# EAGLE design intercom (EAGLE 5.11)
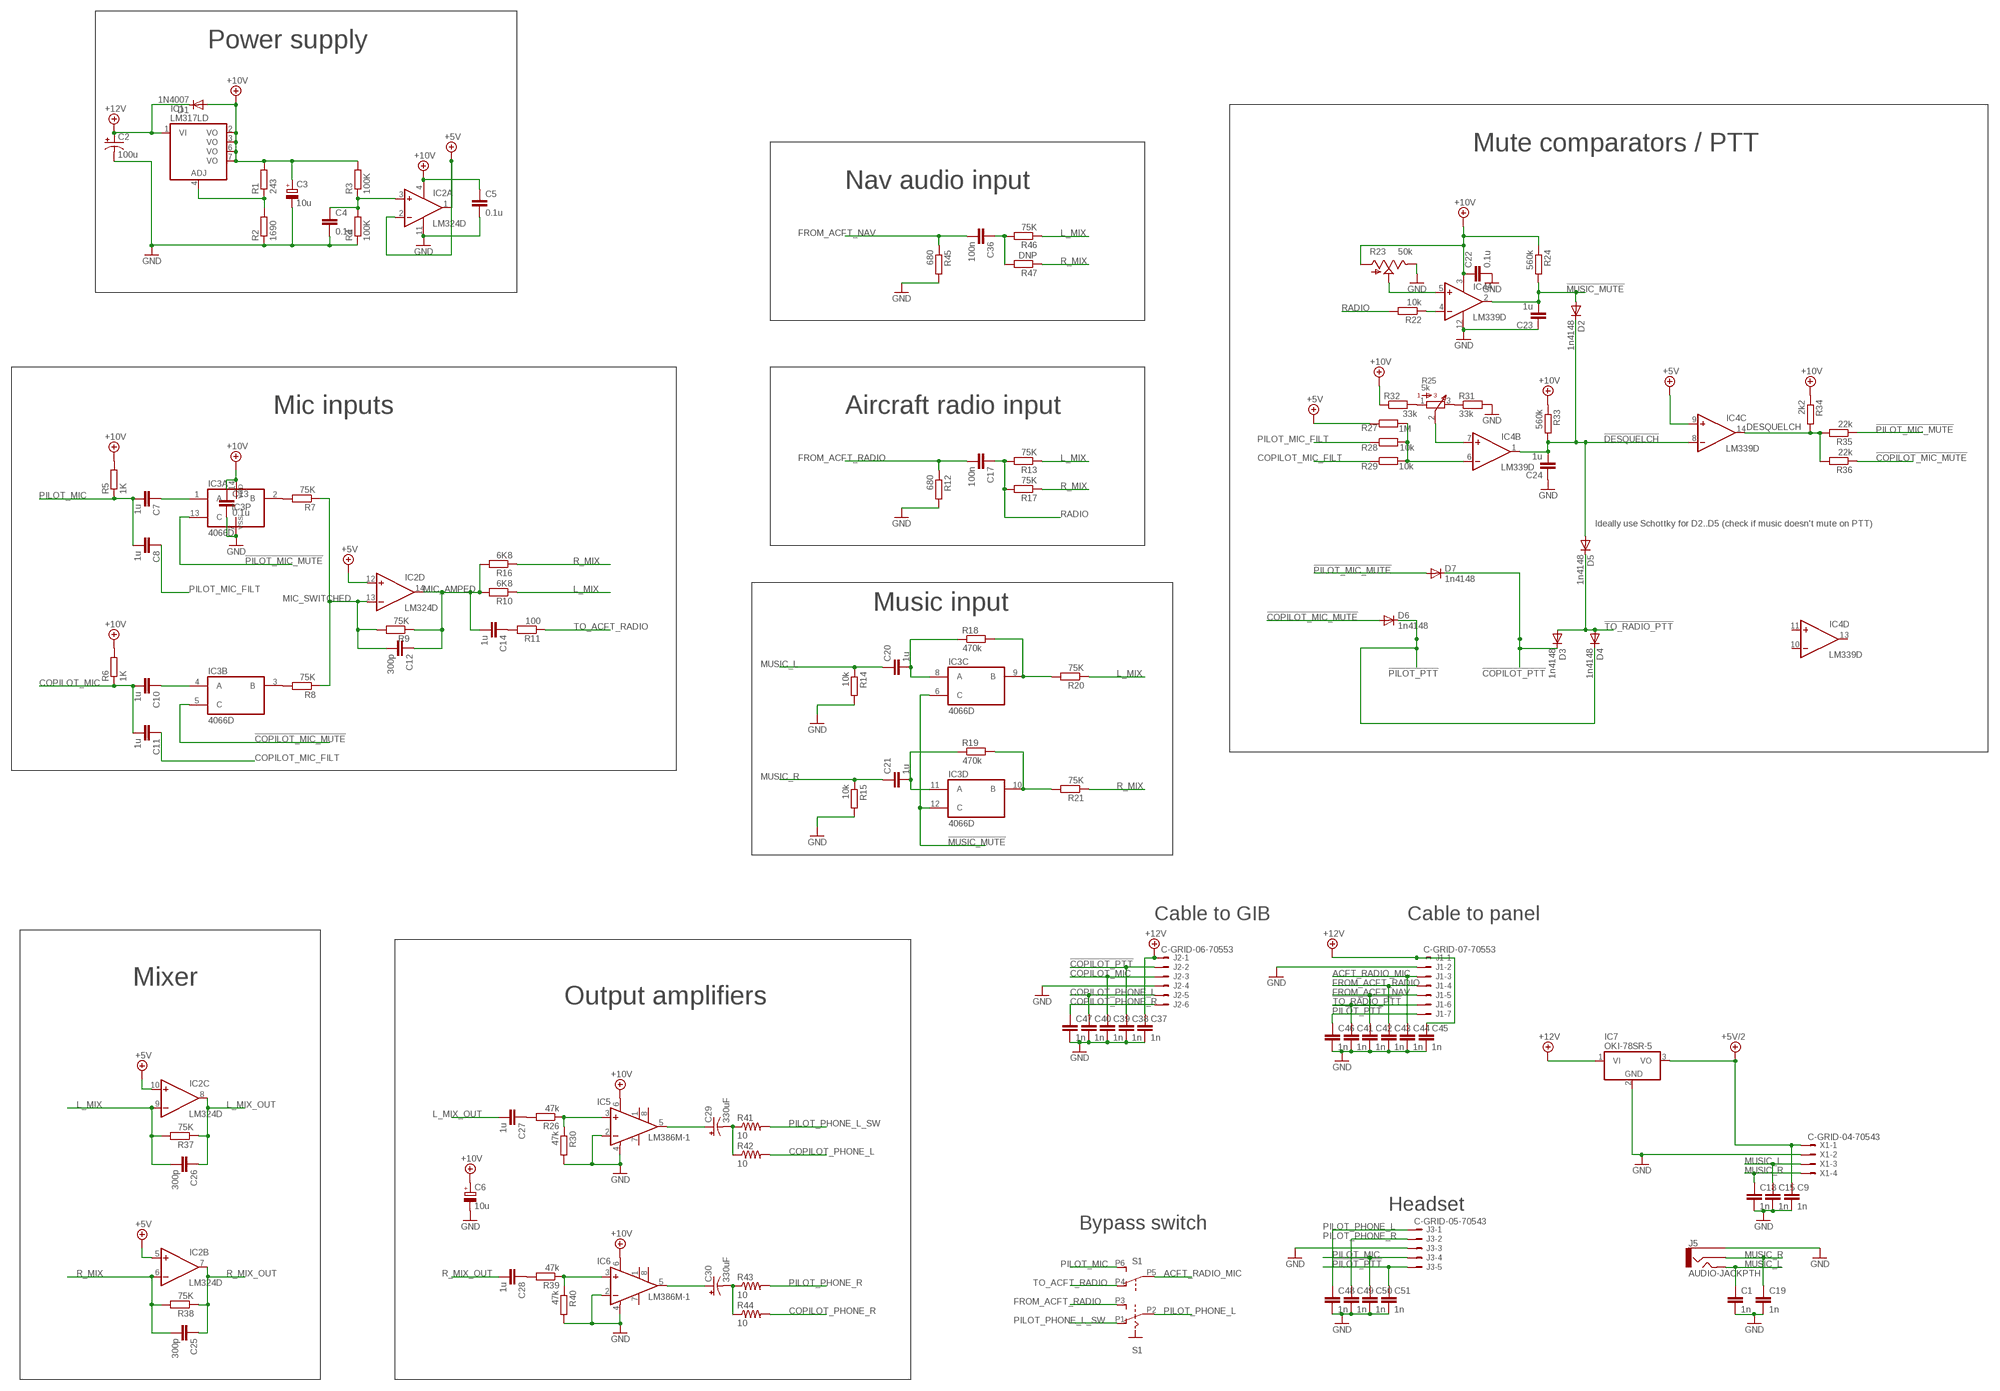
[diagram p0: schematic, sheet 1]

## Parts
C1  1n  C-EUC0603  [C0603]
C2  100u  CPOL-USE2.5-7  [E2,5-7]
C3  10u  CPOL-EUCT3216  [CT3216]
C4  0.1u  C-EUC0603  [C0603]
C5  0.1u  C-EUC0603  [C0603]
C6  10u  CPOL-EUCT3216  [CT3216]
C7  1u  C-EUC0603  [C0603]
C8  1u  C-EUC0603  [C0603]
C9  1n  C-EUC0603  [C0603]
C10  1u  C-EUC0603  [C0603]
C11  1u  C-EUC0603  [C0603]
C12  300p  C-EUC0603  [C0603]
C13  0.1u  C-EUC0603  [C0603]
C14  1u  C-EUC0603  [C0603]
C15  1n  C-EUC0603  [C0603]
C17  100n  C-EUC0603  [C0603]
C18  1n  C-EUC0603  [C0603]
C19  1n  C-EUC0603  [C0603]
C20  1u  C-EUC0603  [C0603]
C21  1u  C-EUC0603  [C0603]
C22  0.1u  C-EUC0603  [C0603]
C23  1u  C-EUC0603  [C0603]
C24  1u  C-EUC0603  [C0603]
C25  300p  C-EUC0603  [C0603]
C26  300p  C-EUC0603  [C0603]
C27  1u  C-EUC0603  [C0603]
C28  1u  C-EUC0603  [C0603]
C29  330uF  CPOL-USE3.5-8  [E3,5-8]
C30  330uF  CPOL-USE3.5-8  [E3,5-8]
C36  100n  C-EUC0603  [C0603]
C37  1n  C-EUC0603  [C0603]
C38  1n  C-EUC0603  [C0603]
C39  1n  C-EUC0603  [C0603]
C40  1n  C-EUC0603  [C0603]
C41  1n  C-EUC0603  [C0603]
C42  1n  C-EUC0603  [C0603]
C43  1n  C-EUC0603  [C0603]
C44  1n  C-EUC0603  [C0603]
C45  1n  C-EUC0603  [C0603]
C46  1n  C-EUC0603  [C0603]
C47  1n  C-EUC0603  [C0603]
C48  1n  C-EUC0603  [C0603]
C49  1n  C-EUC0603  [C0603]
C50  1n  C-EUC0603  [C0603]
C51  1n  C-EUC0603  [C0603]
D1  1N4007  DIODE-C1702-05  [C1702-05]
D2  1n4148  DIODE-SOD323-W  [SOD323-W]
D3  1n4148  DIODE-SOD323-W  [SOD323-W]
D4  1n4148  DIODE-SOD323-W  [SOD323-W]
D5  1n4148  DIODE-SOD323-W  [SOD323-W]
D6  1n4148  DIODE-SOD323-W  [SOD323-W]
D7  1n4148  DIODE-SOD323-W  [SOD323-W]
IC1  LM317LD  [SO08]
IC2  LM324D  [SO14]
IC3  4066D  [SO14]
IC4  LM339D  [SO14]
IC5  LM386M-1  [SO08]
IC6  LM386M-1  [SO08]
IC7  OKI-78SR-5  7805TV  [TO220V]
J1  C-GRID-07-70553  [70553-07]
J2  C-GRID-06-70553  [70553-06]
J3  C-GRID-05-70543  [70543-05]
J5  AUDIO-JACKPTH  [AUDIO-JACK]
R1  243  R-EU_R0603  [R0603]
R2  1690  R-EU_R0603  [R0603]
R3  100K  R-EU_R0603  [R0603]
R4  100K  R-EU_R0603  [R0603]
R5  1K  R-EU_R0603  [R0603]
R6  1K  R-EU_R0603  [R0603]
R7  75K  R-EU_R0603  [R0603]
R8  75K  R-EU_R0603  [R0603]
R9  75K  R-EU_R0603  [R0603]
R10  6K8  R-EU_R0603  [R0603]
R11  100  R-EU_R0603  [R0603]
R12  680  R-EU_R0603  [R0603]
R13  75K  R-EU_R0603  [R0603]
R14  10k  R-EU_R0603  [R0603]
R15  10k  R-EU_R0603  [R0603]
R16  6K8  R-EU_R0603  [R0603]
R17  75K  R-EU_R0603  [R0603]
R18  470k  R-EU_R0603  [R0603]
R19  470k  R-EU_R0603  [R0603]
R20  75K  R-EU_R0603  [R0603]
R21  75K  R-EU_R0603  [R0603]
R22  10k  R-EU_R0603  [R0603]
R23  50k  TRIM_US-B90P  [SP19L]
R24  560k  R-EU_R0603  [R0603]
R25  5k  3310C  [3310C]
R26  47k  R-EU_R0603  [R0603]
R27  1M  R-EU_R0603  [R0603]
R28  10k  R-EU_R0603  [R0603]
R29  10k  R-EU_R0603  [R0603]
R30  47k  R-EU_R0603  [R0603]
R31  33k  R-EU_R0603  [R0603]
R32  33k  R-EU_R0603  [R0603]
R33  560k  R-EU_R0603  [R0603]
R34  2k2  R-EU_R0603  [R0603]
R35  22k  R-EU_R0603  [R0603]
R36  22k  R-EU_R0603  [R0603]
R37  75K  R-EU_R0603  [R0603]
R38  75K  R-EU_R0603  [R0603]
R39  47k  R-EU_R0603  [R0603]
R40  47k  R-EU_R0603  [R0603]
R41  10  R-US_0204/2V  [0204V]
R42  10  R-US_0204/2V  [0204V]
R43  10  R-US_0204/2V  [0204V]
R44  10  R-US_0204/2V  [0204V]
R45  680  R-EU_R0603  [R0603]
R46  75K  R-EU_R0603  [R0603]
R47  DNP  R-EU_R0603  [R0603]
S1  200UM2  [200U-M2]
X1  C-GRID-04-70543  [70543-04]

## Nets
!COPILOT_MIC_MUTE: D6.A IC3.5(B:C) R36.1
!COPILOT_PTT: C38.1 D3.C D7.C J2.2
!DESQUELCH: C24.2 D2.C D5.A IC4.1(B:OUT) IC4.8(C:-IN) R33.2
!MUSIC_MUTE: C23.2 D2.A IC3.6(C:C) IC3.12(D:C) IC4.2(A:OUT) R24.2
!PILOT_MIC_MUTE: D7.A IC3.13(A:C) R35.1
!PILOT_PTT: C46.1 C51.1 D4.C D6.C J1.7 J3.5
!TO_RADIO_PTT: C41.1 D3.A D4.A D5.C J1.6
+5V: IC2.1(A:OUT) IC2.2(A:-IN) IC2.5(B:+IN) IC2.10(C:+IN) IC2.12(D:+IN) IC4.9(C:+IN) R27.1
+5V/2: C9.1 IC7.3(VO) X1.1
+10V: C3.+ C5.1 C6.+ C13.1 C22.1 D1.A IC1.2(VO) IC1.3(VO) IC1.6(VO) IC1.7(VO) IC2.4(P:V+) IC3.14(P:VDD) IC4.3(P:V+) IC5.6(VS) IC6.6(VS) R1.2 R3.2 R5.2 R6.2 R23.A R24.1 R32.1 R33.1 R34.1
+12V: C2.+ C37.1 C45.1 D1.C IC1.1(VI) IC7.1(VI) J1.1 J2.1
ACFT_RADIO_MIC: C44.1 J1.3 S1.P5(B:P)
COPILOT_MIC: C10.2 C11.2 C39.1 J2.3 R6.1
COPILOT_MIC_FILT: C11.1 R29.1
COPILOT_PHONE_L: C40.1 J2.5 R42.2
COPILOT_PHONE_R: C47.1 J2.6 R44.2
DESQUELCH: IC4.14(C:OUT) R34.2 R35.2 R36.2
FROM_ACFT_NAV: C36.2 C42.1 J1.5 R45.1
FROM_ACFT_RADIO: C17.2 C43.1 J1.4 R12.1 S1.P3(A:S)
GND: C1.2 C2.- C3.- C4.2 C5.2 C6.- C9.2 C13.2 C15.2 C18.2 C19.2 C22.2 C23.1 C24.1 C37.2 C38.2 C39.2 C40.2 C41.2 C42.2 C43.2 C44.2 C45.2 C46.2 C47.2 C48.2 C49.2 C50.2 C51.2 IC2.11(P:V-) IC3.7(P:VSS) IC4.12(P:GND) IC5.2(-IN) IC5.4(GND) IC6.2(-IN) IC6.4(GND) IC7.2(GND) J1.2 J2.4 J3.3 J5.1 R2.1 R4.1 R12.2 R14.2 R15.2 R23.E R30.2 R31.2 R40.2 R45.2 X1.2
L_MIX: C26.2 IC2.9(C:-IN) R10.1 R13.1 R20.1 R37.2 R46.1
L_MIX_OUT: C26.1 C27.2 IC2.8(C:OUT) R37.1
MIC_AMPED: C12.1 C14.2 IC2.14(D:OUT) R9.1 R10.2 R16.2
MIC_SWITCHED: C12.2 IC2.13(D:-IN) R7.1 R8.1 R9.2
MUSIC_L: C1.1 C15.1 C20.1 J5.5 R14.1 X1.3
MUSIC_R: C18.1 C19.1 C21.1 J5.2 R15.1 X1.4
N$1: C10.1 IC3.4(B:A)
N$2: IC3.2(A:B) R7.2
N$4: IC1.4(ADJ) R1.1 R2.2
N$5: IC3.3(B:B) R8.2
N$6: C4.1 IC2.3(A:+IN) R3.1 R4.2
N$8: C14.1 R11.2
N$9: IC4.4(A:-IN) R22.1
N$10: C21.2 IC3.11(D:A) R19.1
N$11: C7.1 IC3.1(A:A)
N$13: C20.2 IC3.8(C:A) R18.1
N$15: IC3.10(D:B) R19.2 R21.2
N$16: IC3.9(C:B) R18.2 R20.2
N$17: IC4.5(A:+IN) R23.S
N$20: R25.3 R31.1
N$21: R25.1 R32.2
N$26: C27.1 R26.2
N$27: IC5.3(+IN) R26.1 R30.1
N$28: C28.1 R39.2
N$29: IC6.3(+IN) R39.1 R40.1
N$30: C29.+ IC5.5(OUT)
N$31: C30.+ IC6.5(OUT)
N$32: C29.- R41.1 R42.1
N$33: C30.- R43.1 R44.1
NAV: C36.1 R46.2 R47.2
PILOT_MIC: C7.2 C8.2 C50.1 J3.4 R5.1 S1.P6(B:S)
PILOT_MIC_FILT: C8.1 R28.1
PILOT_PHONE_L: C48.1 J3.1 S1.P2(A:P)
PILOT_PHONE_L_SW: R41.2 S1.P1(A:O)
PILOT_PHONE_R: C49.1 J3.2 R43.2
R_MIX: C25.2 IC2.6(B:-IN) R16.1 R17.1 R21.1 R38.2 R47.1
R_MIX_OUT: C25.1 C28.2 IC2.7(B:OUT) R38.1
RADIO: C17.1 R13.2 R17.2 R22.2
SQUELCH_LVL: IC4.6(B:-IN) R27.2 R28.2 R29.2
SQUELCH_REF: IC4.7(B:+IN) R25.2
TO_ACFT_RADIO: R11.1 S1.P4(B:O)
Unconnected: IC4.10(D:-IN) IC4.11(D:+IN) IC4.13(D:OUT) IC5.1(GAIN) IC5.7(BYPASS) IC5.8(GAIN) IC6.1(GAIN) IC6.7(BYPASS) IC6.8(GAIN)

## Notes on the sheet
- Power supply
- Mute comparators / PTT
- Nav audio input
- Mic inputs | Aircraft radio input
- Ideally use Schottky for D2..D5 (check if music doesn't mute on PTT)
- Music input
- Cable to GIB | Cable to panel
- Mixer
- Output amplifiers
- Headset
- Bypass switch

## Library data of the parts
C1 C4 C5 C7-C15 C17-C28 C36-C51 = rcl:C-EU: CAPACITOR, European symbol
C2 C29 C30 = rcl:CPOL-US: POLARIZED CAPACITOR, American symbol
C3 C6 = rcl:CPOL-EU: POLARIZED CAPACITOR, European symbol
D1-D7 = diode:DIODE-: DIODE
IC1 = linear:LM317LD: LOW CURRENT 1.2 TO 37V ADJUSTABLE VOLTAGE REGULATOR Source: http://pdf.alldatasheet.com
IC2 = linear:LM324: OP AMP
IC3 = 40xx:4066: Quad bilateral ANALOG SWITCH
IC4 = linear:LM339: Low Power Low Offset Voltage Quad Comparators with open collector; LM139/LM239/LM339/LM2901/LM3302
IC5 IC6 = linear:LM386?-*: Low Voltage Audio Power Amplifier Source: http://cache.national.com/ds/LM/LM386.pdf
IC7 = linear:78*: Positive VOLTAGE REGULATOR Source: http://cache.national.com/ds/LM/LM78L05.pdf http://www.fairchildsemi.com/ds/LM/LM7805.pdf
J1 = con-molex:C-GRID-07: CONNECTOR wire to board 2.54 mm (0.100") pitch header; OC_FARNELL: unknown; OC_NEWARK: unknown
J2 = con-molex:C-GRID-06: CONNECTOR wire to board 2.54 mm (0.100") pitch header; OC_FARNELL: unknown; OC_NEWARK: unknown
J3 = con-molex:C-GRID-05: CONNECTOR wire to board 2.54 mm (0.100") pitch header; OC_FARNELL: unknown; OC_NEWARK: unknown
J5 = SparkFun:AUDIO-JACK: 3.5mm Audio Jack Simple 3.5mm common PCB mount audio jack. SKU: PRT-08032
R1-R22 R24 R26-R40 R45-R47 = rcl:R-EU_: RESISTOR, European symbol
R23 = pot:TRIM_US-: POTENTIOMETER
R25 = intercom:3310: Bourns 3310 Potentiometer
R41-R44 = rcl:R-US_: RESISTOR, American symbol
S1 = intercom:200U: TOGGLE SWITCH Lamb E-switch 200U M2 Digikey EG4911-ND Pads for board edge mounting
X1 = con-molex:C-GRID-04: CONNECTOR wire to board 2.54 mm (0.100") pitch header; OC_FARNELL: unknown; OC_NEWARK: unknown

## Board
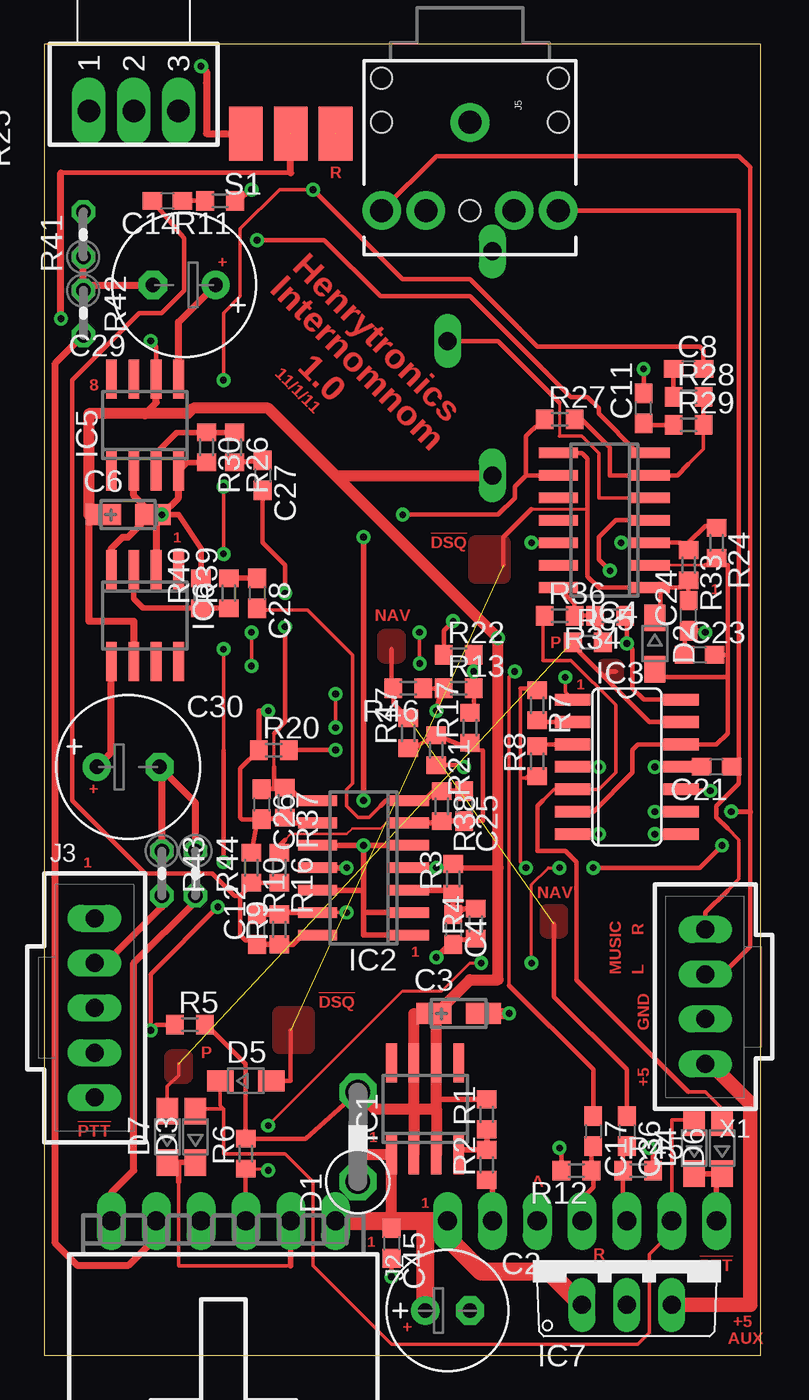
[diagram p1: board, top side]
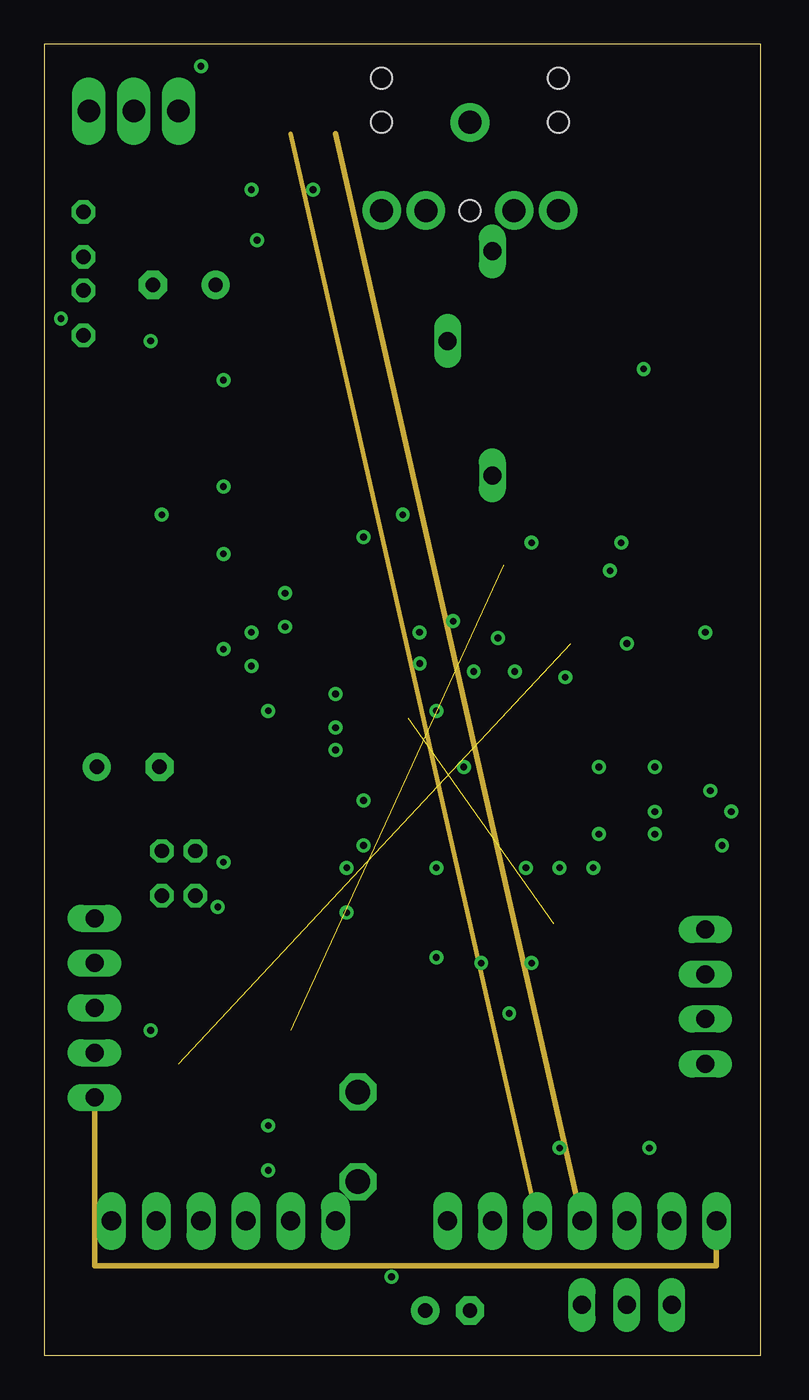
[diagram p2: board, inner layer Route2]
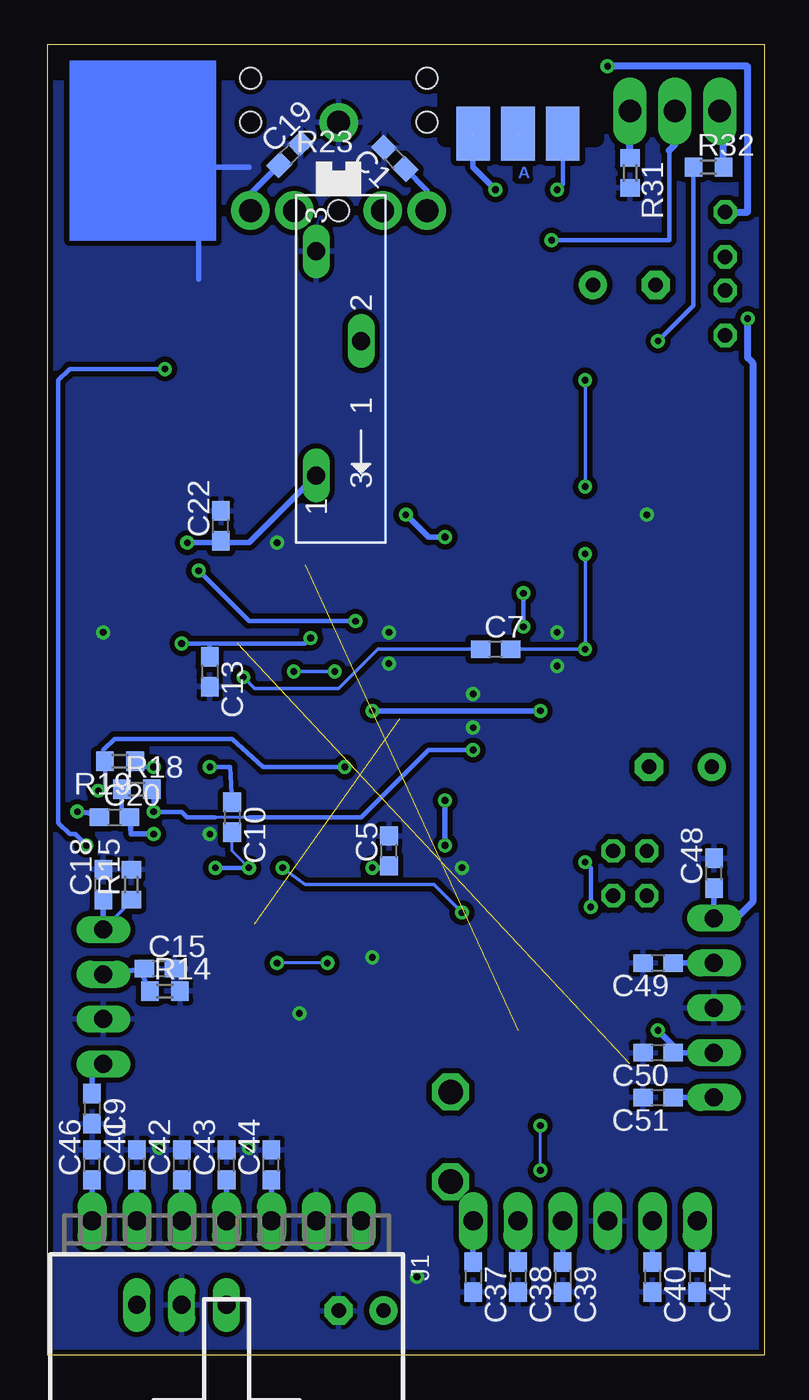
[diagram p3: board, bottom side, seen from below]

Size 40.62 x 74.28 mm. Coordinates in mm from the lower left corner, seen from the top.
Outline: 0,0 40.62,0 40.62,74.28 0,74.28 0,0
Copper layers (1+2*16): Top 0.035mm / dielectric 1.5mm / Route2 0.035mm / dielectric 0.15mm / Bottom 0.035mm
Design rules "default *": minimum track width 6mil, minimum drill 15mil, track to track 6mil, track to pad 6mil, pad to pad 6mil, via to via 6mil, smd to smd 0mil, copper to edge 10mil, drill to drill 8mil, minimum pad ring 10mil, minimum via ring 8mil, stop-mask expansion 4mil, vias tented up to drill 0mil, thermal gap 10mil
bRestrict: area 9.5,68.9 to 18.1,74

### Footprints (pad centres in the part's own frame; a part is rotated, then mirrored left to right if it is on the bottom)
C0603 = smd 1.1 x 1: 1 -0.85,0; 2 0.85,0
E2,5-7 = drill 0.813 pad 1.6 round: + -1.27,0 | drill 0.813 pad 1.6 octagon: - 1.27,0
CT3216 = smd 2 x 1.2: + -1.4,0; - 1.4,0
E3,5-8 = drill 0.813 pad 1.6 round: + -1.778,0 | drill 0.813 pad 1.6 octagon: - 1.778,0
C1702-05 = drill 1.397 octagon: A 2.54,0; C -2.54,0
SOD323-W = smd 1.5 x 1.2: A 1.45,0; C -1.45,0
SO08 = smd 0.6 x 2.2: 1 -1.905,-2.6; 2 -0.635,-2.6; 3 0.635,-2.6; 4 1.905,-2.6; 5 1.905,2.6; 6 0.635,2.6; 7 -0.635,2.6; 8 -1.905,2.6
SO14 = smd 0.6 x 2.2: 1 -3.81,-2.6; 2 -2.54,-2.6; 3 -1.27,-2.6; 4 0,-2.6; 5 1.27,-2.6; 6 2.54,-2.6; 7 3.81,-2.6; 8 3.81,2.6; 9 2.54,2.6; 10 1.27,2.6; 11 0,2.6; 12 -1.27,2.6; 13 -2.54,2.6; 14 -3.81,2.6
SO14' = smd 0.66 x 2.032: 1 -3.81,-3.073; 2 -2.54,-3.073; 3 -1.27,-3.073; 4 0,-3.073; 5 1.27,-3.073; 6 2.54,-3.073; 7 3.81,-3.073; 8 3.81,3.073; 9 2.54,3.073; 10 1.27,3.073; 11 0,3.073; 12 -1.27,3.073; 13 -2.54,3.073; 14 -3.81,3.073
TO220V = drill 1.016 long: 1 -2.54,-2.54; 2 0,-2.54; 3 2.54,-2.54
70553-07 = drill 1.092 long: 1 -7.62,-7.62; 2 -5.08,-7.62; 3 -2.54,-7.62; 4 0,-7.62; 5 2.54,-7.62; 6 5.08,-7.62; 7 7.62,-7.62
70553-06 = drill 1.092 long: 1 -6.35,-7.62; 2 -3.81,-7.62; 3 -1.27,-7.62; 4 1.27,-7.62; 5 3.81,-7.62; 6 6.35,-7.62
70543-05 = drill 1.016 long: 1 -5.08,0; 2 -2.54,0; 3 0,0; 4 2.54,0; 5 5.08,0
AUDIO-JACK = drill 1.3 pad 2.184 round: 1 0,0; 2 5,5; 3 5,2.5; 4 5,-2.5; 5 5,-5 | hole 1.2: 0,5; -2.5,5; -2.5,-5; 0,-5; 5,0
R0603 = smd 1 x 1.1: 1 -0.85,0; 2 0.85,0
SP19L = drill 1.016 long: A 5.715,-1.27; E -6.985,-1.27; S -1.905,1.27
3310C = drill 1.27 long: 1 0,2.54; 2 0,0; 3 0,-2.54
0204V = drill 0.813 octagon: 1 -1.27,0; 2 1.27,0
200U-M2 = smd 1.905 x 3.048: P1 -2.54,1.27; P2 0,1.27; P3 2.54,1.27 | smd 1.905 x 3.048 bottom: P4 -2.54,1.27; P5 0,1.27; P6 2.54,1.27
70543-04 = drill 1.016 long: 1 -3.81,0; 2 -1.27,0; 3 1.27,0; 4 3.81,0

### Placement (x,y rotation side)
C1  20.95,67.81 135 bottom
C2  22.86,2.54 0 top
C3  23.5,19.37 0 top
C4  23.18,24.13 270 top
C5  21.27,28.57 90 bottom
C6  4.76,47.62 0 top
C7  15.24,40 0 bottom
C8  36.51,55.88 0 top
C9  38.1,13.97 270 bottom
C10  30.16,30.48 270 bottom
C11  33.97,53.66 90 top
C12  12.06,24.13 90 top
C13  31.43,38.73 270 bottom
C14  6.98,65.41 180 top
C15  34.29,21.91 0 bottom
C17  31.11,12.7 270 top
C18  37.47,26.67 90 bottom
C19  26.89,68.04 45 bottom
C20  36.83,30.48 0 bottom
C21  38.1,33.34 180 top
C22  30.8,46.99 90 bottom
C23  37.15,39.69 0 top
C24  36.51,41.91 90 top
C25  23.81,31.11 270 top
C26  12.32,31.21 270 top
C27  12.38,49.85 270 top
C28  12.06,43.18 270 top
C29  7.94,60.64 180 top
C30  4.76,33.34 0 top
C36  33.02,12.7 270 top
C37  16.51,4.45 270 bottom
C38  13.97,4.45 270 bottom
C39  11.43,4.45 270 bottom
C40  6.35,4.45 270 bottom
C41  35.56,10.79 90 bottom
C42  33.02,10.79 90 bottom
C43  30.48,10.79 90 bottom
C44  27.94,10.79 90 bottom
C45  19.68,6.35 270 top
C46  38.1,10.79 90 bottom
C47  3.81,4.45 270 bottom
C48  2.86,27.3 90 bottom
C49  6.03,22.23 180 bottom
C50  6.03,17.14 180 bottom
C51  6.03,14.6 180 bottom
D1  17.78,12.38 90 top
D2  34.61,40.32 270 top
D3  8.57,12.38 90 top
D4  36.83,11.75 90 top
D5  11.43,15.56 0 top
D6  38.42,11.75 90 top
D7  6.98,12.38 90 top
IC1  21.59,13.97 0 top
IC2  18.1,27.62 90 top
IC3  4066D  [SO14']  33.02,33.34 270 top
IC4  31.75,47.31 90 top
IC5  5.71,52.7 0 top
IC6  5.71,41.91 180 top
IC7  33.02,5.4 0 top
J1  30.48,0 180 bottom
J2  10.16,0 180 top
J3  2.86,19.68 270 top
J5  24.13,69.85 270 top
R1  25.08,13.65 90 top
R2  25.08,10.79 90 top
R3  23.18,26.99 90 top
R4  24.45,24.45 90 top
R5  8.26,18.73 0 top
R6  11.43,11.43 90 top
R7  27.94,36.83 270 top
R8  27.94,33.66 90 top
R9  13.33,24.13 90 top
R10  11.75,27.62 270 top
R11  9.97,65.41 180 top
R12  30.16,10.48 180 top
R13  23.5,37.78 0 top
R14  33.97,20.64 0 bottom
R15  35.88,26.67 90 bottom
R16  13.33,27.62 270 top
R17  24.13,35.56 90 top
R18  35.56,32.07 0 bottom
R19  36.51,33.66 180 bottom
R20  13.02,34.29 0 top
R21  22.22,34.29 270 top
R22  23.5,39.69 0 top
R23  24.13,55.56 270 bottom
R24  38.1,46.04 270 top
R25  5.08,70.48 90 top
R26  10.79,51.44 270 top
R27  29.21,53.02 0 top
R28  36.51,54.29 0 top
R29  36.51,52.7 0 top
R30  9.21,51.44 270 top
R31  7.62,66.99 270 bottom
R32  3.17,67.31 0 bottom
R33  36.51,44.77 270 top
R34  32.07,41.91 180 top
R35  30.81,40.41 0 top
R36  29.21,41.91 0 top
R37  13.63,31.31 270 top
R38  22.54,31.11 270 top
R39  10.48,43.18 90 top
R40  8.89,43.18 90 top
R41  2.22,63.5 90 top
R42  2.22,59.05 270 top
R43  6.67,27.3 270 top
R44  8.57,27.3 270 top
R45  33.66,10.48 0 top
R46  20.64,37.78 180 top
R47  20.64,35.24 90 top
S1  13.97,67.94 0 top
X1  37.47,20.32 90 top

### Tracks (layer width: path | path; a pad name or v marks a point on that pad's centre or on a via)
!COPILOT_MIC_MUTE
  Top 0.203: 38.42,13.97 37.47,14.92 36.51,14.92 | R36.1 28.27,41.86 28.26,39.37 29.84,39.37 32.38,36.83 32.38,33.02 31.43,32.07 IC3.5 28.89,32.07 28.26,31.43
  Top 0.254: 38.42,13.97 D6.A | 36.51,14.92 30.16,21.27 30.16,27.94 29.53,28.57 27.94,28.57 27.94,31.11 28.26,31.43
!COPILOT_PTT
  Top 0.203: 13.97,5.08 7.62,5.08 7.62,9.84
  Top 0.305: 13.97,5.08 J2.2 | D7.C D3.C 7.62,10.93 7.62,9.84
  Bottom 0.305: J2.2 C38.1
!DESQUELCH  (1 unrouted)
  Top 0.178: 27.62,47.94 30.8,47.94
  Top 0.254: IC4.8 30.48,51.12 30.8,50.8 30.8,47.94 30.8,44.13 31.43,43.5 IC4.1 34.93,43.5 | C24.2 R33.2 36.09,43.5 34.93,43.5 | D2.C 34.93,42.09 34.93,43.5 | 27.62,47.94 26.04,46.36 26.04,44.77 | D5.A 13.97,15.56 13.97,18.42
  pour Top (isolate 0.305): 24.45,46.04 26.04,46.04 26.04,44.13 24.45,44.13
  pour Top (isolate 0.305): 13.33,19.37 14.92,19.37 14.92,17.46 13.33,17.46
!MUSIC_MUTE
  Top 0.152: 37.47,44.77 IC4.2
  Top 0.254: 38.1,44.77 38.74,44.77 38.74,39.69 | 38.1,44.77 37.47,44.77 | 38.74,38.42 38.74,35.24 38.1,34.61 IC3.12 33.66,34.61 33.34,34.29 33.34,33.02 31.11,30.8 IC3.6 | 38.74,38.42 38.74,39.69 | 38.1,44.77 R24.2 | 38.74,39.69 C23.2 | D2.A 35.06,38.42 38.74,38.42
!PILOT_MIC_MUTE  (1 unrouted)
  Top 0.203: D7.A 6.98,15.24 7.62,15.88 7.62,16.51
  Top 0.254: R35.1 29.84,40.32 31.75,38.42 | IC3.13 34.29,35.88 31.75,38.42 | 32.38,38.73 32.07,38.73 31.75,38.42
  pour Top (isolate 0.305): 7.3,16.83 7.3,15.88 7.94,15.88 7.94,16.83
  pour Top (isolate 0.305): 31.74,38.95 32.38,38.42 32.38,38.95
!PILOT_PTT
  Top 0.305: D4.C D6.C 38.1,9.98 J1.7
  Route2 0.305: J3.5 2.86,5.08 38.1,5.08 J1.7
  Bottom 0.305: J1.7 C46.1 | J3.5 C51.1
!TO_RADIO_PTT
  Top 0.203: D4.A 36.83,13.34 35.56,13.34 J1.6 35.56,6.98 34.29,5.72 34.29,1.27 33.66,0.64 19.68,0.64 15.24,5.08 15.24,9.84 13.65,11.43 10.16,11.43 10.16,13.97 | D3.A 8.71,13.97 10.16,13.97 | 10.16,13.97 9.98,14.15 D5.C
  Bottom 0.305: J1.6 C41.1
+5V  (via drill 0.38)
  Top 0.254: v20.32,47.63 25.72,47.63 26.67,48.58 26.67,49.21 27.3,49.85 | 27.3,49.85 IC4.9 | R27.1 27.62,52.39 27.3,52.07 27.3,49.85
  Top 0.305: IC2.12 18.1,26.35 | 18.1,26.35 18.1,25.08 | 18.1,25.08 IC2.2 | IC2.1 18.1,23.81 18.1,25.08 | 18.1,26.35 v18.1,28.89 | v18.1,28.89 IC2.10 | v18.1,28.89 IC2.5 | v18.1,31.43 v18.1,46.36
  Bottom 0.305: v18.1,28.89 v18.1,31.43 | v18.1,46.36 19.05,46.36 v20.32,47.63
+5V/2
  Top 0.813: IC7.3 40.01,2.86 40.01,14.29 37.78,16.51 X1.1
  Bottom 0.305: C9.1 38.1,15.88 X1.1
+10V  (via drill 0.38)
  Top 0.254: v22.22,27.62 22.96,27.62 R3.2 | IC5.6 6.35,57.15 v6.03,57.47 | IC4.3 36.09,46.04 R33.1 36.51,46.04 37.47,46.99 38,46.99 R24.1 | 36.09,37.25 IC3.14 33.97,37.15 33.34,37.78 33.34,40 v33.02,40.32 33.02,41.81 R34.1 | D1.A 14.82,12.28 R6.2 11.43,16.51 9.53,18.42 R5.2
  Top 0.305: 22.22,13.97 22.22,14.5 R1.2 | IC2.4 v22.22,27.62 25.72,27.62 | v32.7,46.04 IC4.3
  Top 0.406: C6.+ 2.54,47.63 2.54,41.59 5.08,41.59 IC6.6 | 5.71,53.34 6.35,53.98 IC5.6
  Top 0.61: D1.A 18.73,13.97 20.95,13.97 | 20.95,13.97 IC1.7 20.95,19.37 C3.+ 22.22,19.37 | 20.95,13.97 IC1.2 | 22.22,13.97 IC1.3 | 20.95,13.97 22.22,13.97 | 22.22,13.97 IC1.6 22.22,19.37 | 2.54,47.63 2.54,53.34 5.71,53.34 8.13,53.34 8.45,53.66 12.7,53.66 16.51,49.85 | 22.22,19.37 24.13,21.27 25.72,21.27 25.72,27.62 v25.72,40.64 16.51,49.85 | 16.51,49.85 R23.A
  Bottom 0.178: C22.1 31.01,46.14 31.11,46.04
  Bottom 0.254: v6.03,57.47 4.03,59.48 R32.1 | v25.72,40.64 26.04,40.32 31.43,40.32 | 31.43,40.32 v33.02,40.32 | 31.43,40.32 C13.1
  Bottom 0.305: C5.1 21.17,27.62 v22.22,27.62 | v32.7,46.04 31.11,46.04 29.21,46.04 R23.A
+12V
  Top 0.254: 19.68,7.62 C45.1
  Top 0.305: 21.59,7.62 20.42,7.3 | 25.08,4.76 25.3,4.76
  Top 0.61: 19.68,7.62 IC1.1 17.78,11.37 D1.C
  Top 1.016: 21.59,7.62 C2.+ | J2.1 19.68,7.62 20.95,7.62 21.59,7.62 | 21.59,7.62 J1.1 23.18,6.35 24.77,4.76 25.08,4.76 28.57,4.76 IC7.1
  Bottom 0.305: C37.1 J2.1
ACFT_RADIO_MIC  (1 unrouted)
  Route2 0.254: J1.3 S1.P5
  Bottom 0.305: J1.3 C44.1
COPILOT_MIC  (via drill 0.38)
  Top 0.178: R6.1 12.48,10.58 v12.7,10.48 | v12.7,13.02 20.32,20.64 22.54,20.64 24.13,22.23 v24.77,22.23 | v27.62,22.23 27.62,26.67 28.57,27.62 v29.21,27.62
  Top 0.254: J2.3 R6.1 | v33.97,55.88 C11.2 | v31.11,27.62 37.15,27.62 v38.42,28.89
  Bottom 0.178: v12.7,10.48 v12.7,13.02 | v24.77,22.23 v27.62,22.23 | C10.2 30.16,28.57 v29.21,27.62
  Bottom 0.254: v33.97,55.88 39.37,55.88 40.01,55.24 40.01,30.16 39.37,29.53 39.05,29.53 v38.42,28.89 | v29.21,27.62 v31.11,27.62
  Bottom 0.305: C39.1 J2.3
COPILOT_MIC_FILT
  Top 0.254: R29.1 34.08,52.7 C11.1
COPILOT_PHONE_L
  Top 0.406: J2.5 6.35,6.67 4.76,5.08 1.91,5.08 0.64,6.35 0.64,56.2 R42.2
  Bottom 0.305: J2.5 C40.1
COPILOT_PHONE_R
  Top 0.406: R44.2 8.57,25.72 5.08,22.23 5.08,10.48 3.81,9.21 J2.6
  Bottom 0.305: J2.6 C47.1
DESQUELCH
  Top 0.254: IC4.14 30.06,42.59 R36.2 30.94,41.91 | 30.94,41.91 31.32,41.52 R35.2 | 30.94,41.91 R34.2
FROM_ACFT_NAV
  Top 0.254: C36.2 32.8,11.75 R45.1 32.8,8.04 J1.5
  Bottom 0.305: J1.5 C42.1
FROM_ACFT_RADIO  (1 unrouted)
  Top 0.254: C17.2 31.01,11.75 R12.1 31.11,10.37 31.11,9.53 30.48,8.89 J1.4
  Route2 0.305: J1.4 S1.P3
  Bottom 0.305: J1.4 C43.1
GND  (via drill 0.38)
  Top 0.203: v21.28,39.2 v21.27,40.96 | v11.75,39.05 v11.75,40.96 | v16.51,35.56 v16.51,37.47
  Top 0.254: v37.47,40.96 37.36,41.06 C24.1 36.3,40.84 C23.1 | R45.2 34.51,11.53 v34.29,11.75 | R12.2 29.31,11.65 v29.21,11.75 | v19.68,4.45 C45.2
  Top 0.305: R2.1 25.4,9.94 J1.2 | R30.2 8.1,50.59 IC5.4 | IC2.11 v17.14,27.62 | R4.1 23.18,23.49 C4.2 22.96,23.28 v22.22,22.54 | R40.2 8.89,45.72 7.62,47.63 v6.67,47.63 | IC3.7 v31.43,29.53 | IC4.12 v27.62,46.04
  Top 0.406: IC5.2 5.08,48.71 C6.- | IC5.4 7.62,48.58 v6.67,47.63 6.35,47.63 | C6.- 6.35,47.63 | 6.35,47.63 IC6.2 | IC6.4 3.81,45.72 4.45,46.36 4.76,46.36 5.71,47.31 5.71,47.63 C6.-
  Top 0.61: C3.- v26.35,19.37
  Bottom 0.305: 29.21,67.31 32.07,67.31 32.07,60.96
  pour Bottom (isolate 0.305): 0,0 40.64,0 40.64,72.07 0,72.07
L_MIX  (via drill 0.38)
  Top 0.254: R10.1 12.06,30.26 C26.2 11.23,30.36 11.11,30.48 11.11,33.23 R20.1 | R46.1 22.54,37.78 R13.1
  Top 0.305: IC2.9 13.44,30.16 R37.2 C26.2 | v22.22,36.51 22.54,37.78 | v12.7,36.51 12.17,36.51 R20.1
  Bottom 0.305: v12.7,36.51 v22.22,36.51
L_MIX_OUT  (via drill 0.38)
  Top 0.178: 13.02,33.34 13.02,35.24
  Top 0.254: C27.2 12.38,46.04 13.65,44.77 v13.65,43.18 | 13.65,40.32 v13.65,41.27 13.65,35.88 13.02,35.24 | 13.02,33.34 13.02,32.16 13.06,32.12
  Top 0.305: C26.1 13.06,32.12 R37.1 13.44,32.07 13.97,32.07 14.61,31.43 IC2.8
  Bottom 0.254: v13.65,41.27 v13.65,43.18
MIC_AMPED
  Top 0.254: 11.85,26.77 R10.2 | 11.11,26.04 11.85,26.77 | 11.11,26.04 11.11,23.81 11.43,23.49 11.85,23.49 | 11.85,26.77 R16.2 | C14.2 7.94,63.28 7.94,60.33 6.67,59.06 5.4,59.06 1.59,55.24 1.59,31.43 5.71,27.31 9.53,27.31 10.79,26.04 11.11,26.04
  Top 0.305: IC2.14 14.61,23.81 14.07,23.28 R9.1 C12.1 11.85,23.49
MIC_SWITCHED  (via drill 0.38)
  Top 0.203: 26.99,32.7 26.99,37.78 | 26.99,32.7 27.3,32.7 | v27.3,27.62 26.99,27.94 26.99,32.7 | IC2.13 v17.14,25.08
  Top 0.254: R7.1 27.84,37.78 26.99,37.78 | 27.3,32.7 27.41,32.81 R8.1
  Top 0.305: C12.2 R9.2 13.44,25.08 IC2.13
  Bottom 0.203: v27.3,27.62 26.04,26.67 18.73,26.67 v17.14,25.08
MUSIC_L  (via drill 0.38)
  Top 0.254: J5.5 22.22,67.95 39.37,67.95 40.01,67.31 40.01,30.8 40.01,23.18 38.42,21.59 X1.3
  Top 0.305: 40.01,30.8 v38.94,30.8
  Bottom 0.254: R14.1 35.39,21.84 35.64,21.84
  Bottom 0.305: C15.1 35.64,21.84 X1.3 | J5.5 19.13,65.99 C1.1 | C20.1 38.3,30.74 v38.94,30.8
MUSIC_R
  Top 0.203: 38.74,26.35 39.37,26.99 39.37,29.21 38.74,29.84 | 39.37,33.34 C21.1
  Top 0.254: J5.2 39.37,64.85 39.37,33.34 39.37,32.38 38.1,31.11 38.1,30.48 38.74,29.84 | X1.4 37.47,25.08 38.74,26.35
  Bottom 0.203: R15.1 35.88,25.72 X1.4
  Bottom 0.305: X1.4 C18.1 | C19.1 29.13,65.8 J5.2
N$1  (via drill 0.38)
  Top 0.254: v31.43,33.34 IC3.4
  Bottom 0.254: C10.1 30.27,33.34 v31.43,33.34
N$2
  Top 0.254: R7.2 28.04,35.88 IC3.2
N$4
  Top 0.305: IC1.4 23.5,11.65 R2.2 R1.1
N$5
  Top 0.254: R8.2 28.04,34.61 IC3.3
N$6
  Top 0.305: R4.2 23.71,25.3 23.5,25.08 C4.1 R3.1 22.96,26.35 IC2.3
N$8
  Top 0.254: C14.1 R11.2
N$9  (via drill 0.38)
  Top 0.254: R22.1 22.64,41.06 v23.18,41.59 | v32.07,44.45 31.43,45.09 31.43,46.36 32.38,47.31 IC4.4
  Bottom 0.254: v23.18,41.59 29.21,41.59 v32.07,44.45
N$10  (via drill 0.38)
  Top 0.203: IC3.11 C21.2
  Top 0.254: v34.61,33.34 IC3.11
  Bottom 0.254: R19.1 35.35,33.34 v34.61,33.34
N$11  (via drill 0.38)
  Top 0.203: v29.53,38.42 29.53,37.57 IC3.1
  Bottom 0.203: C7.1 21.91,40 24.13,37.78 28.89,37.78 v29.53,38.42
N$13  (via drill 0.38)
  Top 0.305: IC3.8 v34.61,29.53
  Bottom 0.254: C20.2 36.41,30.59 R18.1
  Bottom 0.305: v34.61,29.53 35.88,29.53 C20.2
N$15  (via drill 0.38)
  Top 0.254: v37.75,31.99 IC3.10 | R21.2 23.56,33.44 v23.78,33.33
  Bottom 0.254: v37.75,31.99 37.36,32.17 R19.2 37.47,33.76 37.47,34.29 36.83,34.93 30.16,34.93 28.42,33.33 v23.78,33.33
N$16  (via drill 0.38)
  Top 0.254: v34.61,30.8 IC3.9 | R20.2 v16.51,34.29
  Bottom 0.178: 29.21,30.48 31.11,30.48
  Bottom 0.254: R18.2 34.61,32.07 v34.61,30.8 33.02,30.8 32.7,30.48 31.11,30.48 | v16.51,34.29 19.05,34.29 22.86,30.48 29.21,30.48
N$17
  Top 0.178: 29.21,53.98 29.21,52.07
  Top 0.203: IC4.5 31.43,48.58 31.43,51.12 30.48,52.07 29.21,52.07
  Top 0.254: 29.21,53.98 25.72,57.47 R23.S
N$20
  Bottom 0.406: R31.1 R25.3
N$21
  Bottom 0.406: R32.2 2.33,70.27 R25.1
N$26
  Top 0.305: R26.2 C27.1
N$27
  Top 0.305: IC5.3 6.35,51.12 7.52,52.28 R30.1 R26.1
N$28
  Top 0.305: R39.2 C28.1
N$29
  Top 0.305: IC6.3 5.08,42.86 5.61,42.33 R40.1 R39.1
N$30
  Top 0.406: C29.+ 7.62,58.55 IC5.5
N$31
  Top 0.406: C30.+ 3.81,34.16 IC6.5
N$32
  Top 0.406: R41.1 R42.1 2.22,60.64 C29.-
N$33
  Top 0.406: R43.1 6.67,33.21 C30.- 8.57,31.31 R44.1
NAV  (1 unrouted)
  Top 0.254: R47.2 19.79,36.94 R46.2 19.68,37.88 19.68,40 | C36.1 33.02,16.19 28.89,20.32 28.89,24.45
  pour Top (isolate 0.305): 28.57,25.08 28.57,24.13 29.21,24.13 29.21,25.08
  pour Top (isolate 0.305): 19.37,40.64 19.37,39.69 20,39.69 20,40.64
PILOT_MIC  (via drill 0.38)
  Top 0.203: 10.16,34.29 v10.16,40 | v10.16,45.4 v10.16,49.21 | v10.16,55.24 10.16,59.06 11.11,60.01 11.11,63.82 13.33,66.04 v15.24,66.04
  Top 0.254: v9.84,25.4 6.03,21.59 v6.03,18.42 6.35,18.73 R5.1 | v10.16,27.94 10.16,34.29 | C8.2 37.36,56.94 37.15,57.15 27.94,57.15 24.13,60.96 20.32,60.96 v15.24,66.04
  Bottom 0.203: v10.16,45.4 v10.16,40 C7.2 | v10.16,49.21 v10.16,55.24
  Bottom 0.254: v9.84,25.4 9.84,27.62 v10.16,27.94
  Bottom 0.305: J3.4 C50.1 5.18,17.57 v6.03,18.42 | v15.24,66.04 16.51,67.31 S1.P6
PILOT_MIC_FILT
  Top 0.254: R28.1 C8.1
PILOT_PHONE_L  (via drill 0.38)
  Top 0.254: 0.95,66.99 13.97,66.99
  Top 0.406: 13.97,66.99 S1.P2 | v0.95,58.74 0.95,66.99
  Bottom 0.305: J3.1 C48.1
  Bottom 0.406: v0.95,58.74 0.95,56.52 0.64,56.2 0.64,25.72 1.59,24.76 J3.1
PILOT_PHONE_L_SW  (via drill 0.38)
  Top 0.406: v8.89,73.02 9.21,72.71 9.21,72.07 9.21,69.21 S1.P1
  Bottom 0.406: R41.2 0.95,64.77 0.95,73.02 v8.89,73.02
PILOT_PHONE_R
  Top 0.406: R43.2 6.67,25.4 3.49,22.23 J3.2
  Bottom 0.305: J3.2 C49.1
R_MIX
  Top 0.152: 13.65,29.21 13.97,29.53 17.14,29.53 17.46,29.84 19.05,29.84 19.37,30.16 IC2.6
  Top 0.254: R16.1 13.33,28.89 13.65,29.21 | R47.1 21.06,34.39 21.27,34.61 R21.1 23.5,34.61 23.71,34.71 R17.1 23.91,34.29 24.86,34.28 24.86,30.47 24.87,30.26 C25.2
  Top 0.305: IC2.6 22.44,30.16 R38.2 C25.2
R_MIX_OUT
  Top 0.203: 19.05,31.11 18.41,30.48 17.78,30.48 17.14,31.11 17.14,32.07 17.46,32.38 17.46,39.69 14.92,42.23 12.17,42.23 C28.2
  Top 0.254: IC2.7 19.37,31.43 19.05,31.11
  Top 0.305: IC2.7 21.59,31.43 22.12,31.97 R38.1 C25.1
RADIO  (via drill 0.38)
  Top 0.203: 26.35,20.95 26.35,38.42 v26.67,38.73
  Top 0.254: R17.2 24.34,36.63 R13.2 v24.34,38.73 24.34,39.05 R22.2 | C17.1 31.11,16.19 26.35,20.95
  Bottom 0.203: v26.67,38.73 v24.34,38.73
SQUELCH_LVL
  Top 0.203: 36.51,50.48 37.36,51.33 R29.2
  Top 0.254: R27.2 30.48,53.02 32.07,51.44 32.07,49.85 IC4.6 35.88,49.85 36.51,50.48 | R29.2 R28.2
SQUELCH_REF  (via drill 0.38)
  Top 0.254: v12.06,63.18 15.88,63.18 19.05,60.01 24.13,60.01 29.84,54.29 30.8,54.29 31.43,53.66 31.43,53.34 33.66,51.12 IC4.7
  Bottom 0.254: 5.4,68.26 5.4,63.18 v12.06,63.18
  Bottom 0.406: R25.2 5.08,68.58 5.4,68.26
TO_ACFT_RADIO  (via drill 0.38)
  Top 0.254: R11.1 11.11,65.51 v11.75,66.04
  Bottom 0.254: v11.75,66.04 11.43,66.36 S1.P4
(copper drawn outside any net)
  shapes: Bottom area x1

### Text on the board
Top: R | + | Henrytronics | Internomnom | 11/1/11 | 1.0 | 8 | 1 | !DSQ | 1 | NAV | P | 1 | + | 1 | NAV | R | 1 | MUSIC | L | !DSQ | GND | P | +5 | !PTT | 1 | A | 1 | 1 | R | !PTT | +5 | + | AUX
Bottom: A